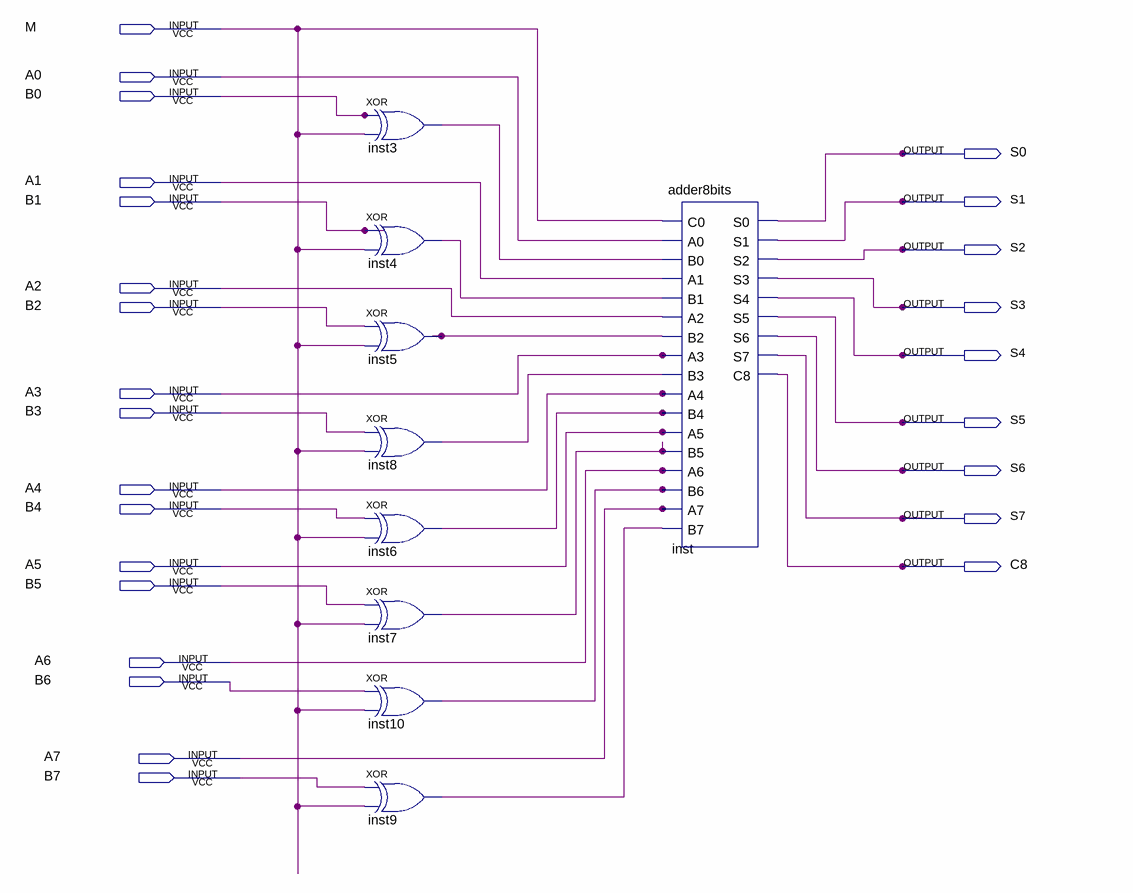
[diagram p0: schematic sheet]
// Quartus schematic addersubtractor8bits.bdf as structural Verilog: 9 symbols, 26 pins
module addersubtractor8bits (
  input  M,
  input  A0,
  input  B0,
  input  A1,
  input  B1,
  input  A2,
  input  B2,
  input  A3,
  input  B3,
  input  A4,
  input  B4,
  input  A5,
  input  B5,
  input  A6,
  input  B6,
  input  A7,
  input  B7,
  output S0,
  output S1,
  output S2,
  output S3,
  output S4,
  output S5,
  output S6,
  output S7,
  output C8
);

  wire inst3_out, inst4_out, inst5_out, inst6_out, inst7_out, inst8_out, inst9_out, inst10_out;

  xor inst3 (inst3_out, B0, M);
  xor inst4 (inst4_out, B1, M);
  xor inst5 (inst5_out, B2, M);
  xor inst8 (inst8_out, B3, M);
  xor inst6 (inst6_out, B4, M);
  xor inst7 (inst7_out, B5, M);
  xor inst10 (inst10_out, B6, M);
  xor inst9 (inst9_out, B7, M);
  adder8bits inst (
    .C0(M), .A0(A0), .B0(inst3_out), .A1(A1), .B1(inst4_out), .A2(A2), .B2(inst5_out), .A3(A3),
    .B3(inst8_out), .A4(A4), .B4(inst6_out), .A5(A5), .B5(inst7_out), .A6(A6), .B6(inst10_out), .A7(A7),
    .B7(inst9_out), .S0(S0), .S1(S1), .S2(S2), .S3(S3), .S4(S4), .S5(S5), .S6(S6), .S7(S7), .C8(C8));
endmodule
